# EAGLE board zx80 SD_12 (smd) build006.1 (STM32) (EAGLE 9.6.2), part 1 of 2
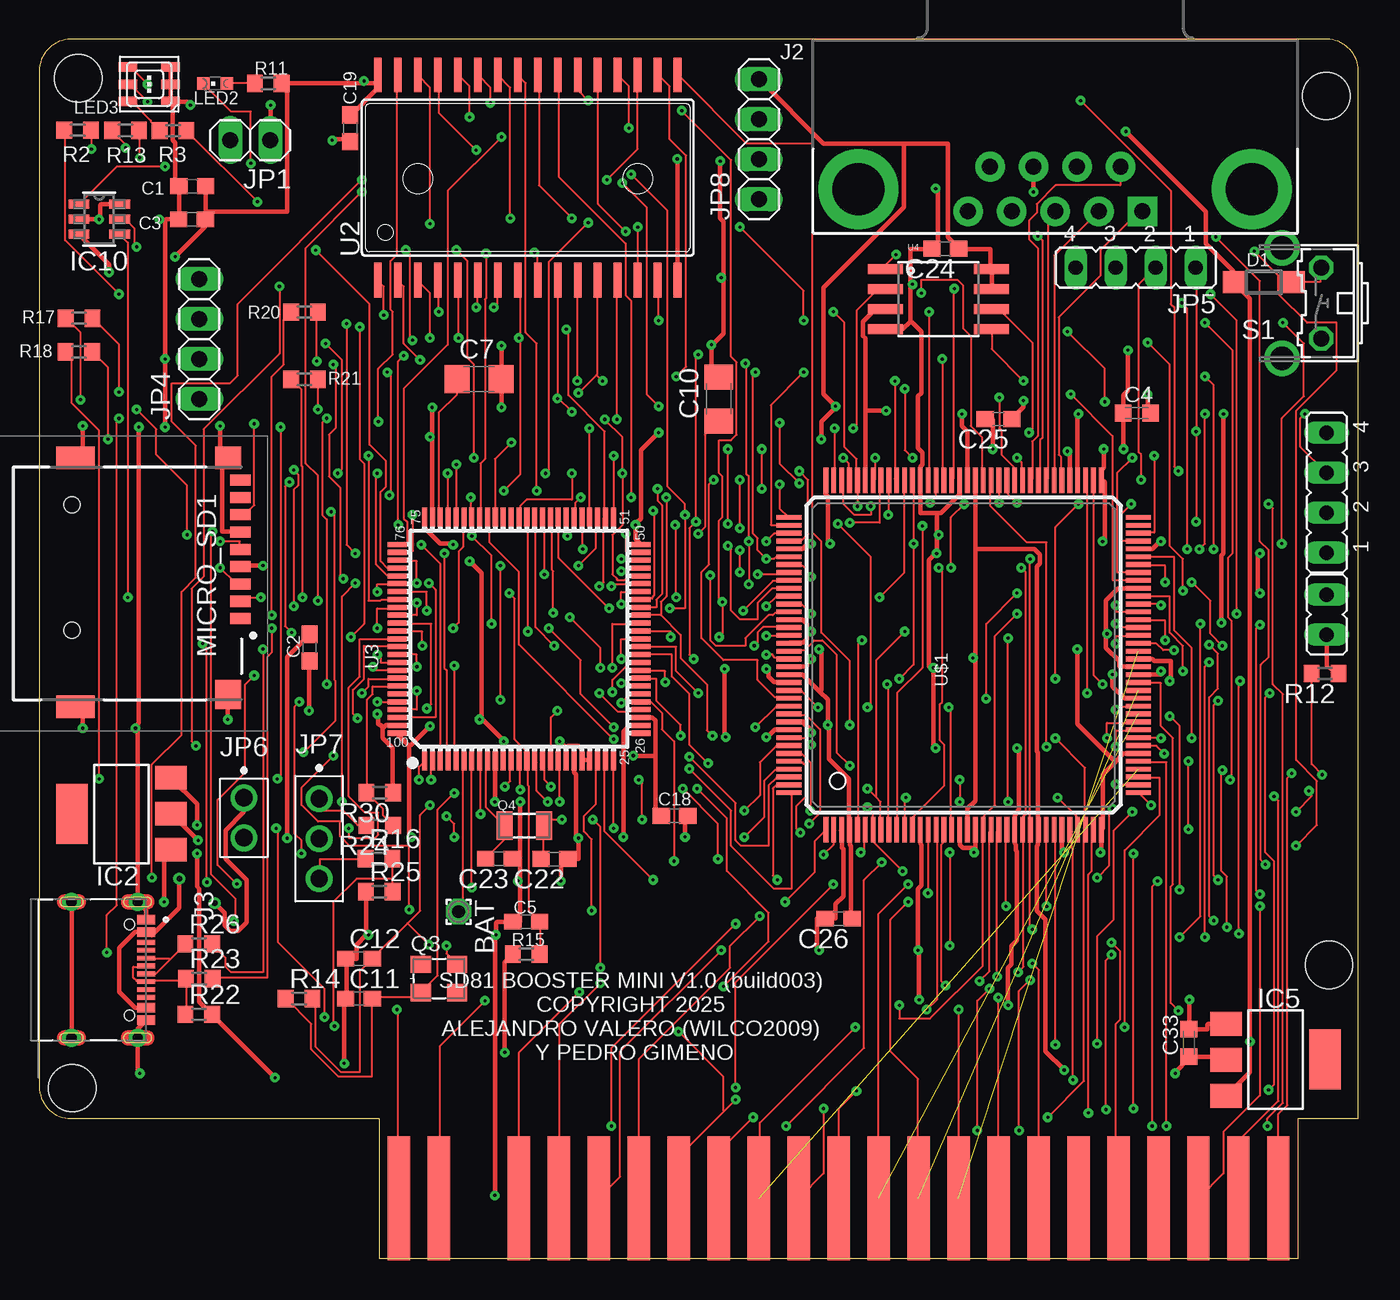
[diagram p3: board, top side]
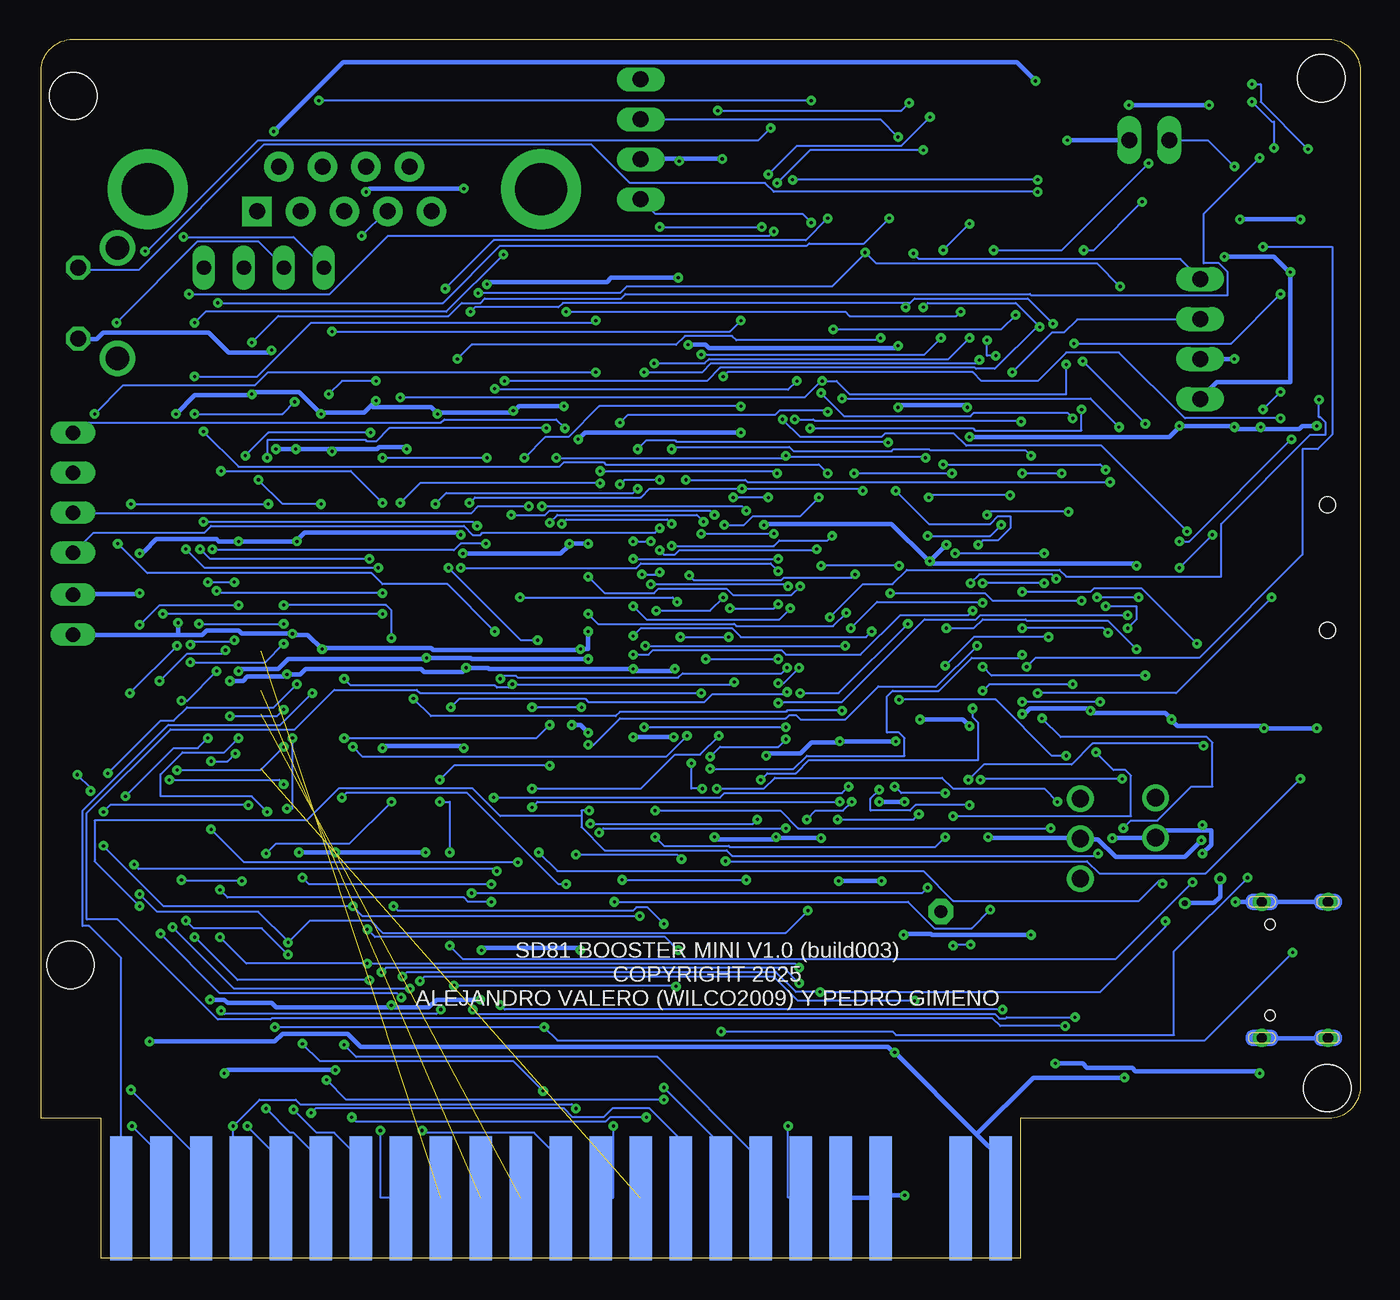
[diagram p4: board, bottom side, seen from below]

Size 83.82 x 77.47 mm. Coordinates in mm from the lower left corner, seen from the top.
Outline: 2,8.89 21.59,8.89 21.59,0 80.01,0 80.01,8.89 83.82,8.89 83.82,75.47 arc90 81.82,77.47 2,77.47 arc90 0,75.47 0,10.89 arc90 2,8.89
Copper layers (1*16): Top 0.035mm / dielectric 1.5mm / Bottom 0.035mm
Design rules "default *": minimum track width 5mil, minimum drill 0.2mm, track to track 6mil, track to pad 6mil, pad to pad 6mil, via to via 6mil, smd to smd 6mil, copper to edge 40mil, drill to drill 6mil, minimum pad ring 10mil, minimum via ring 8mil, stop-mask expansion 4mil, vias tented up to drill 999mil, thermal gap 10mil
Net classes: 1 VCC: width 0.3 mm; 2 3,3: width 0.3 mm
Holes 3 mm at 2.09,10.82 2.46,74.99 81.79,73.87 81.96,18.64

## Footprints (pad centres in the part's own frame; a part is rotated, then mirrored left to right if it is on the bottom)
EDGEPIN = smd 1.422 x 7.874: 1 0,0
1,6/0,8 = drill 0.813 pad 1.6 octagon: 1 0,0
C0603 = smd 1.1 x 1: 1 -0.85,0; 2 0.85,0
C0603K = smd 1.05 x 1.08: 1 -0.875,0; 2 0.875,0
C1206 = smd 1.6 x 1.8: 1 -1.4,0; 2 1.4,0
SOD123 = smd 1.4 x 1.4: A 1.9,0; C -1.9,0
SOT223 = smd 1.499 x 2.007: 1 -2.261,-3.15; 2 0.025,-3.15; 3 2.311,-3.15 | smd 3.81 x 2.007: 4 0,3.15
SOT-23-6_MC = smd 1.321 x 0.559: 1 -1.295,0.95; 2 -1.295,0; 3 -1.295,-0.95; 4 1.295,-0.95; 5 1.295,0; 6 1.295,0.95
DB9_MALE = drill 1.016 pad 1.88 square: 1 5.54,-1.42 | drill 1.016 pad 1.88: 2 2.77,-1.42; 3 0,-1.42; 4 -2.77,-1.42; 5 -5.54,-1.42; 6 4.15,1.42; 7 1.38,1.42; 8 -1.38,1.42; 9 -4.15,1.42 | drill 3.302 pad 5.08: G1 -12.5,0; G2 12.5,0
SHOUHAN_TYPE-C_16PIN_2MD__073_ = smd 0.6 x 1.14: A1_B12 -3.2,3.675; A4_B9 -2.4,3.675; B1_A12 3.2,3.675; B4_A9 2.4,3.675 | smd 0.3 x 1.14: A5 -1.25,3.675; A6 -0.25,3.675; A7 0.25,3.675; A8 1.25,3.675; B5 1.75,3.675; B6 0.75,3.675; B7 -0.75,3.675; B8 -1.75,3.675 | drill 0.65 pad 0.95: SH1 -4.325,3.125; SH2 4.325,3.125; SH3 -4.325,-1.075; SH4 4.325,-1.075 | hole 0.65: -2.89,2.605; 2.89,2.605
1X02 = drill 1.016 long: 1 -1.27,0; 2 1.27,0
JP1 = drill 0.914 long: 1 0,-1.27; 2 0,1.27
JP4 = drill 0.914 long: 1 -3.81,0; 2 -1.27,0; 3 1.27,0; 4 3.81,0
1X04 = drill 1.016 long: 1 -3.81,0; 2 -1.27,0; 3 1.27,0; 4 3.81,0
HDRV2W64P254_2X1_300X350X838B = drill 1.105 pad 1.705: 1 0,0; 2 0,-2.54
HDRV3W64P254_3X1_300X654X838B = drill 1.105 pad 1.705: 1 0,0; 2 0,-2.54; 3 0,-5.08
CHIPLED_0603 = smd 0.8 x 0.8: A 0,-0.75; C 0,0.75
3535-PLCC6 = smd 1.2 x 0.6: P1 1.35,-1.1; P2 1.35,0; P3 1.35,1.1; P4 -1.35,1.1; P5 -1.35,0; P6 -1.35,-1.1
TF-01A = smd 0.7 x 1.3: 1 2.23,7.174; 2 1.13,7.174; 3 0.03,7.174; 4 -1.07,7.174; 5 -2.17,7.174; 6 -3.27,7.174; 7 -4.37,7.174; 8 -5.47,7.174; CD1 -6.57,7.174 | smd 1.448 x 1.651: MP1 -7.989,6.4 | smd 1.448 x 2.438: MP2 -7.989,-3.3; MP3 7.836,-3.3 | smd 1.854 x 1.651: MP4 7.061,6.4 | hole 1: -5.004,-3.531; 2.972,-3.531
3.2X2.5_KX-7 = smd 1.3 x 1.1: 1 -1.15,-0.9; 2 1.15,-0.9; 3 1.15,0.9; 4 -1.15,0.9
3.2X1.5 = smd 1 x 1.8: 1 -1.25,0; 2 1.25,0
R0603 = smd 1 x 1.1: 1 -0.85,0; 2 0.85,0
B3F-31XX = drill 1.016 octagon: 1 -2.261,-1.245; 2 2.261,-1.245 | drill 1.499 pad 2.159: 3 -3.505,1.245; 4 3.505,1.245
SOP32-5 = smd 2.2 x 0.5: 1 -6.516,9.525; 2 -6.516,8.255; 3 -6.516,6.985; 4 -6.516,5.715; 5 -6.516,4.445; 6 -6.516,3.175; 7 -6.516,1.905; 8 -6.516,0.635; 9 -6.516,-0.635; 10 -6.516,-1.905; 11 -6.516,-3.175; 12 -6.516,-4.445; 13 -6.516,-5.715; 14 -6.516,-6.985; 15 -6.516,-8.255; 16 -6.516,-9.525; 17 6.516,-9.525; 18 6.516,-8.255; 19 6.516,-6.985; 20 6.516,-5.715; 21 6.516,-4.445; 22 6.516,-3.175; 23 6.516,-1.905; 24 6.516,-0.635; 25 6.516,0.635; 26 6.516,1.905; 27 6.516,3.175; 28 6.516,4.445; 29 6.516,5.715; 30 6.516,6.985; 31 6.516,8.255; 32 6.516,9.525
LQFP100-0.5-13.8X13.8MM = smd 1.2 x 0.32: 1 -7.75,6; 2 -7.75,5.5; 3 -7.75,5; 4 -7.75,4.5; 5 -7.75,4; 6 -7.75,3.5; 7 -7.75,3; 8 -7.75,2.5; 9 -7.75,2; 10 -7.75,1.5; 11 -7.75,1; 12 -7.75,0.5; 13 -7.75,0; 14 -7.75,-0.5; 15 -7.75,-1; 16 -7.75,-1.5; 17 -7.75,-2; 18 -7.75,-2.5; 19 -7.75,-3; 20 -7.75,-3.5; 21 -7.75,-4; 22 -7.75,-4.5; 23 -7.75,-5; 24 -7.75,-5.5; 25 -7.75,-6; 51 7.75,-6; 52 7.75,-5.5; 53 7.75,-5; 54 7.75,-4.5; 55 7.75,-4; 56 7.75,-3.5; 57 7.75,-3; 58 7.75,-2.5; 59 7.75,-2; 60 7.75,-1.5; 61 7.75,-1; 62 7.75,-0.5; 63 7.75,0; 64 7.75,0.5; 65 7.75,1; 66 7.75,1.5; 67 7.75,2; 68 7.75,2.5; 69 7.75,3; 70 7.75,3.5; 71 7.75,4; 72 7.75,4.5; 73 7.75,5; 74 7.75,5.5; 75 7.75,6 | smd 0.32 x 1.2: 26 -6,-7.75; 27 -5.5,-7.75; 28 -5,-7.75; 29 -4.5,-7.75; 30 -4,-7.75; 31 -3.5,-7.75; 32 -3,-7.75; 33 -2.5,-7.75; 34 -2,-7.75; 35 -1.5,-7.75; 36 -1,-7.75; 37 -0.5,-7.75; 38 0,-7.75; 39 0.5,-7.75; 40 1,-7.75; 41 1.5,-7.75; 42 2,-7.75; 43 2.5,-7.75; 44 3,-7.75; 45 3.5,-7.75; 46 4,-7.75; 47 4.5,-7.75; 48 5,-7.75; 49 5.5,-7.75; 50 6,-7.75; 76 6,7.75; 77 5.5,7.75; 78 5,7.75; 79 4.5,7.75; 80 4,7.75; 81 3.5,7.75; 82 3,7.75; 83 2.5,7.75; 84 2,7.75; 85 1.5,7.75; 86 1,7.75; 87 0.5,7.75; 88 0,7.75; 89 -0.5,7.75; 90 -1,7.75; 91 -1.5,7.75; 92 -2,7.75; 93 -2.5,7.75; 94 -3,7.75; 95 -3.5,7.75; 96 -4,7.75; 97 -4.5,7.75; 98 -5,7.75; 99 -5.5,7.75; 100 -6,7.75
SO08-EIAJ = smd 0.61 x 2.21: 1 -1.905,-3.378; 2 -0.635,-3.378; 3 0.635,-3.378; 4 1.905,-3.378; 5 1.905,3.353; 6 0.635,3.353; 7 -0.635,3.353; 8 -1.905,3.353
TQ144 = smd 1.6 x 0.3: P1 -11.1,8.75; P2 -11.1,8.25; P3 -11.1,7.75; P4 -11.1,7.25; P5 -11.1,6.75; P6 -11.1,6.25; P7 -11.1,5.75; P8 -11.1,5.25; P9 -11.1,4.75; P10 -11.1,4.25; P11 -11.1,3.75; P12 -11.1,3.25; P13 -11.1,2.75; P14 -11.1,2.25; P15 -11.1,1.75; P16 -11.1,1.25; P17 -11.1,0.75; P18 -11.1,0.25; P19 -11.1,-0.25; P20 -11.1,-0.75; P21 -11.1,-1.25; P22 -11.1,-1.75; P23 -11.1,-2.25; P24 -11.1,-2.75; P25 -11.1,-3.25; P26 -11.1,-3.75; P27 -11.1,-4.25; P28 -11.1,-4.75; P29 -11.1,-5.25; P30 -11.1,-5.75; P31 -11.1,-6.25; P32 -11.1,-6.75; P33 -11.1,-7.25; P34 -11.1,-7.75; P35 -11.1,-8.25; P36 -11.1,-8.75; P73 11.1,-8.75; P74 11.1,-8.25; P75 11.1,-7.75; P76 11.1,-7.25; P77 11.1,-6.75; P78 11.1,-6.25; P79 11.1,-5.75; P80 11.1,-5.25; P81 11.1,-4.75; P82 11.1,-4.25; P83 11.1,-3.75; P84 11.1,-3.25; P85 11.1,-2.75; P86 11.1,-2.25; P87 11.1,-1.75; P88 11.1,-1.25; P89 11.1,-0.75; P90 11.1,-0.25; P91 11.1,0.25; P92 11.1,0.75; P93 11.1,1.25; P94 11.1,1.75; P95 11.1,2.25; P96 11.1,2.75; P97 11.1,3.25; P98 11.1,3.75; P99 11.1,4.25; P100 11.1,4.75; P101 11.1,5.25; P102 11.1,5.75; P103 11.1,6.25; P104 11.1,6.75; P105 11.1,7.25; P106 11.1,7.75; P107 11.1,8.25; P108 11.1,8.75 | smd 0.3 x 1.6: P37 -8.75,-11.1; P38 -8.25,-11.1; P39 -7.75,-11.1; P40 -7.25,-11.1; P41 -6.75,-11.1; P42 -6.25,-11.1; P43 -5.75,-11.1; P44 -5.25,-11.1; P45 -4.75,-11.1; P46 -4.25,-11.1; P47 -3.75,-11.1; P48 -3.25,-11.1; P49 -2.75,-11.1; P50 -2.25,-11.1; P51 -1.75,-11.1; P52 -1.25,-11.1; P53 -0.75,-11.1; P54 -0.25,-11.1; P55 0.25,-11.1; P56 0.75,-11.1; P57 1.25,-11.1; P58 1.75,-11.1; P59 2.25,-11.1; P60 2.75,-11.1; P61 3.25,-11.1; P62 3.75,-11.1; P63 4.25,-11.1; P64 4.75,-11.1; P65 5.25,-11.1; P66 5.75,-11.1; P67 6.25,-11.1; P68 6.75,-11.1; P69 7.25,-11.1; P70 7.75,-11.1; P71 8.25,-11.1; P72 8.75,-11.1; P109 8.75,11.1; P110 8.25,11.1; P111 7.75,11.1; P112 7.25,11.1; P113 6.75,11.1; P114 6.25,11.1; P115 5.75,11.1; P116 5.25,11.1; P117 4.75,11.1; P118 4.25,11.1; P119 3.75,11.1; P120 3.25,11.1; P121 2.75,11.1; P122 2.25,11.1; P123 1.75,11.1; P124 1.25,11.1; P125 0.75,11.1; P126 0.25,11.1; P127 -0.25,11.1; P128 -0.75,11.1; P129 -1.25,11.1; P130 -1.75,11.1; P131 -2.25,11.1; P132 -2.75,11.1; P133 -3.25,11.1; P134 -3.75,11.1; P135 -4.25,11.1; P136 -4.75,11.1; P137 -5.25,11.1; P138 -5.75,11.1; P139 -6.25,11.1; P140 -6.75,11.1; P141 -7.25,11.1; P142 -7.75,11.1; P143 -8.25,11.1; P144 -8.75,11.1

## Placement (x,y rotation side)
1A  D7  [EDGEPIN]  22.86,3.81 0 top
1B  VCC  [EDGEPIN]  22.86,3.81 180 bottom
2A  /RAMCS  [EDGEPIN]  25.4,3.81 0 top
2B  9V  [EDGEPIN]  25.4,3.81 180 bottom
4A  D0  [EDGEPIN]  30.48,3.81 0 top
4B  GND  [EDGEPIN]  30.48,3.81 180 bottom
5A  D1  [EDGEPIN]  33.02,3.81 0 top
5B  GND  [EDGEPIN]  33.02,3.81 180 bottom
6A  D2  [EDGEPIN]  35.56,3.81 0 top
6B  /CLOCK  [EDGEPIN]  35.56,3.81 180 bottom
7A  D6  [EDGEPIN]  38.1,3.81 0 top
7B  A0  [EDGEPIN]  38.1,3.81 180 bottom
8A  D5  [EDGEPIN]  40.64,3.81 0 top
8B  A1  [EDGEPIN]  40.64,3.81 180 bottom
9A  D3  [EDGEPIN]  43.18,3.81 0 top
9B  A2  [EDGEPIN]  43.18,3.81 180 bottom
10A  D4  [EDGEPIN]  45.72,3.81 0 top
10B  A3  [EDGEPIN]  45.72,3.81 180 bottom
11A  A6  [EDGEPIN]  48.26,3.81 0 top
11B  A15  [EDGEPIN]  48.26,3.81 180 bottom
12A  /NMI  [EDGEPIN]  50.8,3.81 0 top
12B  A14  [EDGEPIN]  50.8,3.81 180 bottom
13A  /HALT  [EDGEPIN]  53.34,3.81 0 top
13B  A13  [EDGEPIN]  53.34,3.81 180 bottom
14A  /MREQ  [EDGEPIN]  55.88,3.81 0 top
14B  A12  [EDGEPIN]  55.88,3.81 180 bottom
15A  /IORQ  [EDGEPIN]  58.42,3.81 0 top
15B  A11  [EDGEPIN]  58.42,3.81 180 bottom
16A  /RD  [EDGEPIN]  60.96,3.81 0 top
16B  A10  [EDGEPIN]  60.96,3.81 180 bottom
17A  /WR  [EDGEPIN]  63.5,3.81 0 top
17B  A9  [EDGEPIN]  63.5,3.81 180 bottom
18A  /BUSAK  [EDGEPIN]  66.04,3.81 0 top
18B  A8  [EDGEPIN]  66.04,3.81 180 bottom
19A  /WAIT  [EDGEPIN]  68.58,3.81 0 top
19B  A7  [EDGEPIN]  68.58,3.81 180 bottom
20A  /BUSRQ  [EDGEPIN]  71.12,3.81 0 top
20B  A6  [EDGEPIN]  71.12,3.81 180 bottom
21A  /RESET  [EDGEPIN]  73.66,3.81 0 top
21B  A5  [EDGEPIN]  73.66,3.81 180 bottom
22A  /M1  [EDGEPIN]  76.2,3.81 0 top
22B  A4  [EDGEPIN]  76.2,3.81 180 bottom
23A  /RFSH  [EDGEPIN]  78.74,3.81 0 top
23B  /ROMCS  [EDGEPIN]  78.74,3.81 180 bottom
BAT  [1,6/0,8]  26.64,22.03 270 top
C1  100nF  [C0603]  9.72,68.13 180 top
C2  100nF  [C0603]  17.17,38.81 270 top
C3  100nF  [C0603]  9.71,66.02 180 top
C4  100nF  [C0603K]  69.75,53.73 0 top
C5  22pF  [C0603]  30.94,21.39 0 top
C7  10uF  [C1206]  27.94,55.88 0 top
C10  10uF  [C1206]  43.18,54.61 90 top
C11  22pF  [C0603]  20.32,16.51 0 top
C12  22pF  [C0603]  20.32,19.05 0 top
C18  100nF  [C0603]  40.37,28.11 0 top
C19  100nF  [C0603]  19.75,71.81 270 top
C22  22pF  [C0603]  32.73,25.38 180 top
C23  22pF  [C0603]  29.21,25.4 180 top
C24  0.1uF  [C0603]  57.58,64.17 180 top
C25  0.1uF  [C0603]  60.96,53.34 180 top
C26  100nF  [C0603]  50.8,21.59 180 top
C33  10uF  [C0603K]  73.05,13.7 90 top
D1  [SOD123]  77.81,62.03 0 top
IC2  REG1117  [SOT223]  5.23,28.23 90 top
IC5  1.2V  [SOT223]  78.57,12.64 270 top
IC10  MCP4725  [SOT-23-6_MC]  3.81,66.04 0 top
J2  JOYSTICK  [DB9_MALE]  64.57,67.96 0 top
J3  TYPE-C_16PIN_2MD__073_  [SHOUHAN_TYPE-C_16PIN_2MD__073_]  3.12,18.33 270 top
JP1  SOUND  [1X02]  13.41,71.06 180 top
JP2  [JP1]  81.81,40.91 0 top
JP3  JTAG  [JP4]  81.81,48.65 90 top
JP4  SERIAL  [1X04]  10.16,58.42 90 top
JP5  RGB  [JP4]  69.68,62.96 180 top
JP6  PWR_SRC  [HDRV2W64P254_2X1_300X350X838B]  13,29.26 0 top
JP7  BOOT  [HDRV3W64P254_3X1_300X654X838B]  17.78,29.21 0 top
JP8  ST-LINK-V2  [1X04]  45.72,71.12 90 top
LED2  SD  [CHIPLED_0603]  11.18,74.66 90 top
LED3  STATUS  [3535-PLCC6]  6.98,74.62 0 top
MICRO_SD1  TF-01A  [TF-01A]  5.6,42.89 270 top
Q3  8MHz  [3.2X2.5_KX-7]  25.4,17.78 0 top
Q4  32767Hz  [3.2X1.5]  30.82,27.49 0 top
R2  150  [R0603]  2.44,71.69 0 top
R3  68  [R0603]  8.51,71.67 180 top
R11  680  [R0603]  14.56,74.66 180 top
R12  2K  [R0603]  81.71,37.16 180 top
R13  150  [R0603]  5.48,71.67 180 top
R14  1M  [R0603]  16.51,16.51 0 top
R15  [R0603]  30.94,19.34 180 top
R16  510  [R0603]  21.59,25.4 0 top
R17  3k3  [R0603]  2.52,59.75 0 top
R18  3k3  [R0603]  2.52,57.61 0 top
R20  3k3  [R0603]  16.85,60.14 0 top
R21  3k3  [R0603]  16.85,55.86 180 top
R22  1K5  [R0603]  10.14,15.5 0 top
R23  22R  [R0603]  10.16,17.78 0 top
R24  510  [R0603]  21.63,27.51 180 top
R25  10K  [R0603]  21.6,23.3 0 top
R26  22R  [R0603]  10.13,19.98 0 top
R30  10K  [R0603]  21.63,29.59 180 top
S1  RESET  [B3F-31XX]  80.22,60.71 90 top
U2  AS6C4008  [SOP32-5]  31.04,68.68 90 top
U3  MCU-STM32F407VET6(LQFP100)  [LQFP100-0.5-13.8X13.8MM]  30.48,39.37 90 top
U4  FLASH-SPI-25XX  [SO08-EIAJ]  57.15,60.96 270 top
U$1  XC6SLX9-2TQG144C  [TQ144]  58.74,38.34 90 top

## Tracks (layer width: path | path; a pad name or v marks a point on that pad's centre or on a via)
1V2  (via drill 0.2)
  Top 0.3: IC5.2 75.4,12.66 75.4,12.8 73.09,12.8 C33.1 73.03,12.66 72.19,11.82 v72.19,11.75 | 59.47,45.07 59.47,49.4 U$1.P89 | 59.47,45.07 59.47,38.16 | 59.47,38.16 59.47,29.08 58.98,28.59 58.98,27.26 U$1.P19 | 59.47,45.07 63.25,45.07 63.59,44.72 63.59,44.16 63.39,43.95 63.39,32.22 63.46,32.15 63.46,27.26 U$1.P28 63.46,27.12 63.46,26.28 63.39,26.21 63.39,22.09 63.94,21.53 63.94,13.15 v65.13,11.96 | v49.07,38.09 48.79,37.81 48.79,37.6 47.67,37.6 U$1.P128 | v59.33,38.16 59.47,38.16 | v71.28,37.32 71.28,37.11 69.88,37.11 U$1.P52
  Bottom 0.3: v49.07,38.09 56.47,38.09 56.54,38.16 v59.33,38.16 59.47,38.09 68.14,38.09 68.76,37.46 71.14,37.46 v71.28,37.32 | v72.19,11.75 71.98,11.96 v65.13,11.96
3V3  (via drill 0.2)
  Top 0.3: C26.1 51.58,21.6 51.58,26.21 51.51,26.28 51.51,27.19 U$1.P4 51.51,27.33 51.44,27.4 51.44,30.47 50.18,31.73 50.18,33.76 v50.11,33.9 50.11,35.5 49.59,36.03 | 48.79,39.83 48.79,40.32 48.51,40.6 47.67,40.6 U$1.P122 | 48.79,39.83 48.79,39.34 48.58,39.14 47.67,39.14 U$1.P125 | v49.07,33.41 49.07,33.55 48.58,34.04 48.58,34.11 47.67,34.11 U$1.P135 | 49.59,36.03 48.51,37.11 47.67,37.11 U$1.P129 | v49.56,38.72 49.69,38.58 49.69,36.13 49.59,36.03 | v49.07,39.83 48.79,39.83 | 59.4,26.07 59.47,26.07 59.47,27.19 U$1.P20 | 59.4,26.07 58.71,26.07 58.5,26.28 58.5,27.19 U$1.P18 | v65.13,25.79 64.99,25.93 64.99,27.19 U$1.P31 | v67.44,25.79 67.51,25.86 67.51,27.19 U$1.P36 67.58,27.33 67.58,30.75 68.38,31.56 | 68.38,31.56 68.9,32.08 69.81,32.08 U$1.P42 | v59.4,25.79 59.4,26.07 | 67.79,39.69 67.79,41.79 68.56,42.56 69.81,42.56 U$1.P63 | 67.79,39.69 67.79,38.79 68.62,37.95 68.62,37.6 69.81,37.6 U$1.P53 | R12.1 81.83,37.62 81.83,39.62 JP2.1 | v67.86,39.69 67.79,39.69 | 68.38,31.56 65.97,33.97 v65.97,38.72 | 52.49,53.87 52.49,58.48 52.35,58.62 52.35,59.53 53.12,60.3 53.75,60.3 U4.3 | 52.49,53.87 52.49,49.47 U$1.P103 | v70.44,54.92 70.44,53.87 70.58,53.73 C4.2 | v66.04,53.66 65.97,53.59 65.97,49.47 U$1.P76 | v62.55,54.5 62.55,54.08 61.85,53.38 C25.1 | v58.64,53.66 58.64,52.9 58.98,52.55 58.98,49.47 U$1.P90 | v53.82,53.87 52.49,53.87 | U4.7 60.52,61.63 60.52,62.74 U4.8 60.45,62.88 60.45,64.14 58.5,64.14 C24.1 58.36,64.28 57.73,64.91 57.73,70.85 54.93,70.85 | 54.93,70.85 49.83,70.85 45.78,74.9 JP8.4 | 54.93,70.85 54.93,66.8 49.83,61.7 49.83,54.92 v50.6,54.15 50.53,54.01 49.69,53.17 v49.69,52.06
  Top 0.3: 23.5,32.57 22.73,33.34 U3.100 | 23.5,32.57 23.5,26.91 v23.64,26.77 | v10.09,26.56 8.41,28.24 IC2.2 | 39.15,31.94 39.15,34.18 38.94,34.39 38.24,34.39 U3.28 | 39.15,31.94 39.15,28.52 39.5,28.17 C18.1 | U3.22 34.96,31.66 34.54,31.66 U3.21 34.47,31.8 34.47,32.36 34.26,32.57 33.56,32.57 33.45,32.46 | 33.45,32.46 33.49,32.43 33.49,31.66 U3.19 | 33.45,32.46 v33.07,32.85 | U3.11 29.51,31.66 v29.51,32.85 29.44,32.99 28.11,34.31 | v26.3,45.35 26.3,45.42 25.46,45.42 24.48,46.4 24.48,47.1 U3.75 | v27.34,44.3 28.11,43.54 28.11,34.31 | U3.50 38.17,45.42 37.89,45.7 v37.89,46.61 37.96,46.75 38.24,47.03 38.24,51.36 v39.36,52.48 | v14.21,44.02 12.81,44.02 MICRO_SD1.4 | v37.75,31.94 39.15,31.94 | v24.83,33.83 23.64,32.64 23.5,32.57 | v27.97,34.25 28.11,34.31 | v75.12,40.39 75.12,44.65 75.26,44.79 v75.26,53.66
  Bottom 0.3: v49.07,33.41 49.56,33.9 v50.11,33.9 | v49.07,39.83 49.07,38.72 v49.56,38.72 49.69,38.65 58.92,38.65 59.06,38.79 65.83,38.79 v65.97,38.72 66.88,39.62 67.72,39.62 v67.86,39.69 71.07,39.69 71.28,39.9 73.3,39.9 73.58,39.62 75.12,39.62 | v67.44,25.79 v65.13,25.79 v59.4,25.79 | 75.12,39.62 81.76,39.62 JP2.1 | 62.86,54.19 63.32,53.73 65.9,53.73 v66.04,53.66 67.44,55.06 70.3,55.06 v70.44,54.92 70.58,54.85 74.07,54.85 v75.26,53.66 | 62.86,54.19 v62.55,54.5 | 62.86,54.19 62.76,54.08 59.06,54.08 v58.64,53.66 58.5,53.73 53.96,53.73 v53.82,53.87 53.68,53.94 53.47,54.15 v50.6,54.15 | v23.64,26.77 23.57,26.7 17.84,26.7 JP7.2 17.63,26.63 16.66,26.63 15.54,25.51 11.14,25.51 v10.09,26.56 | v29.51,32.85 v33.07,32.85 33.21,32.78 34.89,32.78 35.58,32.08 37.61,32.08 v37.75,31.94 | v27.34,44.3 v26.3,45.35 | v37.89,46.61 37.82,46.68 29.79,46.68 27.48,44.37 v27.34,44.3 | v14.21,44.02 14.35,44.16 27.27,44.16 v27.34,44.3 | v24.83,33.83 25.25,34.25 v27.97,34.25 | v49.69,52.06 49.28,52.48 v39.36,52.48 | v75.12,40.39 75.12,39.62
/CLOCK  (via drill 0.2)
  Top 0.127: v61.43,22.37 61.43,27.19 U$1.P24 | v44.25,21.25 36.35,13.36 v36.35,8.4
  Bottom 0.127: v61.43,22.37 61.15,22.09 46.2,22.09 45.99,22.3 45.3,22.3 v44.25,21.25 | v36.35,8.4 36.35,3.86 35.58,3.86 6B.1
/HALT  (via drill 0.2)
  Top 0.127: 53.33,3.86 13A.1 53.34,21.9 v55.21,23.77 | v67.86,33.06 67.86,34.04 69.81,34.04 U$1.P46 | v68.2,28.59 68,28.38 68,24.96 v67.23,24.19
  Bottom 0.127: v67.86,33.06 67.86,28.59 v68.2,28.59 | v67.23,24.19 66.81,23.77 v55.21,23.77
/IORQ  (via drill 0.2)
  Top 0.127: v72.4,15.73 71.91,16.22 71.91,23.63 72.05,23.77 72.05,33.06 71.28,33.83 71.28,36.55 69.88,36.55 U$1.P51 | v58.43,15.8 58.43,3.86 15A.1
  Bottom 0.127: v72.4,15.73 72.19,15.53 58.71,15.53 v58.43,15.8
/M1  (via drill 0.2)
  Top 0.127: v73.23,33.06 73.23,38.79 72.12,39.9 72.12,44.58 69.88,44.58 U$1.P67 | v78.47,29.36 78.75,29.08 78.75,10.01 76.24,7.49 76.24,3.86 22A.1
  Bottom 0.127: v73.23,33.06 73.86,32.43 75.4,32.43 v78.47,29.36
/MEM_CE  (via drill 0.2)
  Top 0.127: v62.13,48.01 61.57,48.56 61.57,49.33 61.5,49.4 U$1.P85 | v72.4,50.03 72.12,50.31 72.12,60.44 71.91,60.65 71.91,67.84 v66.18,73.57 | v34.89,73.57 34.26,74.2 34.26,75.18 U2.22
  Bottom 0.127: v62.13,48.01 64.15,50.03 v72.4,50.03 | v34.89,73.57 v66.18,73.57
/MEM_OE  (via drill 0.2)
  Top 0.127: v58.15,61.63 58.08,61.56 58.08,49.54 58.01,49.47 U$1.P92 | v33.84,66.1 31.74,68.19 31.74,75.18 U2.24
  Bottom 0.127: v58.15,61.63 55.07,64.7 35.24,64.7 v33.84,66.1
/MREQ  (via drill 0.2)
  Top 0.127: v68.42,34.87 68.42,35.08 69.81,35.08 U$1.P48 | v71.84,34.45 72.47,33.83 v72.47,23.42 | v55.21,22.65 54.1,21.53 54.1,13.15 55.84,11.41 55.84,3.86 14A.1
  Bottom 0.127: v68.42,34.87 68.83,34.45 v71.84,34.45 | v72.47,23.42 71.98,22.93 56.96,22.93 56.68,22.65 v55.21,22.65
/NMI  (via drill 0.2)
  Top 0.127: v71.28,33.06 69.88,33.06 U$1.P44 | v69.46,28.38 68.28,27.19 68.28,21.53 67.23,20.48 v67.23,13.64 | v51.93,10.64 50.81,9.52 50.81,3.86 12A.1
  Bottom 0.127: v71.28,33.06 72.19,32.15 74.84,32.15 76.24,30.75 76.24,29.36 70.44,29.36 v69.46,28.38 | v67.23,13.64 66.11,12.52 53.82,12.52 v51.93,10.64
/OE_OL  (via drill 0.2)
  Top 0.127: v36.98,43.67 36.98,43.81 38.17,43.81 U3.47 | v57.17,43.88 57.38,43.67 57.38,35.36 57.24,35.22 57.24,32.92 57.52,32.64 57.52,30.05 55.49,28.03 55.49,27.26 U$1.P12
  Bottom 0.127: v36.98,43.67 37.47,44.16 45.71,44.16 45.99,43.88 v57.17,43.88
/RAMCS  (via drill 0.2)
  Top 0.127: v59.75,17.62 60.38,18.25 60.38,27.12 60.45,27.19 U$1.P22 | v28.32,16.36 25.46,13.5 25.46,3.86 2A.1
  Bottom 0.127: v59.75,17.62 59.47,17.9 37.26,17.9 35.72,16.36 v28.32,16.36
/RD  (via drill 0.2)
  Top 0.127: v72.12,38.65 71.42,38.65 71,39.06 69.88,39.06 U$1.P56 | v76.31,36.69 76.24,36.62 v76.24,20.62 | v60.94,16.57 60.94,3.86 16A.1
  Bottom 0.127: v72.12,38.65 72.33,38.44 74.56,38.44 v76.31,36.69 | v76.24,20.62 72.47,16.85 61.22,16.85 v60.94,16.57
/RESET  (via drill 0.2)
  Top 0.127: v21.48,35.36 22.66,35.36 U3.96 | v16.52,35.36 16.24,35.08 16.24,26.98 16.66,26.56 v16.66,25.72 | v49,28.45 49,31.52 48.44,32.08 47.67,32.08 U$1.P139 | v77.56,22.37 77.56,10.36 75.26,8.05 75.26,5.4 73.72,3.86 21A.1
  Bottom 0.127: v16.52,35.36 v21.48,35.36 | v16.66,25.72 16.8,25.58 39.92,25.58 40.27,25.93 48.02,25.93 49.49,27.4 49.49,28.1 | 49.49,28.1 49.49,28.45 v49,28.45 | v77.56,22.37 80.43,25.23 80.43,27.82 66.95,27.82 64.92,29.84 56.4,29.84 54.65,28.1 49.49,28.1
/RFSH  (via drill 0.2)
  Top 0.127: v67.58,36.48 67.02,37.04 67.02,49.4 U$1.P74 | v79.59,30.82 79.31,30.54 79.31,9.73 78.75,9.17 78.75,3.86 23A.1
  Bottom 0.127: v67.58,36.48 69.04,35.01 74.56,35.01 75.4,34.18 76.24,34.18 v79.59,30.82
/ROMCS  (via drill 0.2)
  Top 0.127: v66.6,35.92 66.6,49.33 66.53,49.4 U$1.P75
  Bottom 0.127: v66.6,35.92 68.62,33.9 75.75,33.9 81.2,28.45 81.2,21.11 80.78,21.11 78.75,19.09 78.75,3.86 23B.1
/WAIT  (via drill 0.2)
  Top 0.127: v35.1,22.09 35.1,26.63 34.61,27.12 34.61,28.1 35.38,28.87 35.38,31.52 35.45,31.59 U3.23 | v68.14,20.07 68.69,19.51 68.69,15.18 68.42,14.9 68.42,4 68.56,3.86 19A.1 | v71.28,41.51 71.28,41.58 69.88,41.58 U$1.P61 | v77.56,40.25 77.36,40.04 77.36,23.35 v77.56,23.14
  Bottom 0.127: v35.1,22.09 36.49,20.7 62.13,20.7 62.9,21.46 66.74,21.46 v68.14,20.07 68.14,20.14 70.02,22.02 76.45,22.02 v77.56,23.14 | v71.28,41.51 76.31,41.51 v77.56,40.25
/WR  (via drill 0.2)
  Top 0.127: v32.3,29.01 31.6,29.71 31.6,31.52 31.53,31.59 U3.15 | v35.17,27.89 35.66,27.4 v35.66,18.46 | v63.11,18.74 63.53,18.32 63.53,3.86 17A.1 | v68.42,40.32 68.42,40.11 69.81,40.11 U$1.P58 | v73.79,40.32 73.79,21.74 v72.47,20.41
  Bottom 0.127: v32.3,29.01 32.86,28.45 34.61,28.45 v35.17,27.89 | v35.66,18.46 35.94,18.74 v63.11,18.74 70.79,18.74 v72.47,20.41 | v73.79,40.32 v68.42,40.32
/WR'  (via drill 0.2)
  Top 0.127: v53.12,50.87 53.12,49.54 53.05,49.47 U$1.P102 | v39.36,54.15 38.59,54.92 38.59,66.8 v37.05,68.33 | v27.76,70.43 25.39,72.8 25.39,75.18 U2.29
  Bottom 0.127: v53.12,50.87 51.79,52.2 50.32,52.2 48.37,54.15 v39.36,54.15 | v37.05,68.33 34.96,70.43 v27.76,70.43
A0  (via drill 0.2)
  Top 0.127: v64.57,13.57 64.57,27.12 64.5,27.19 U$1.P30
  Bottom 0.127: v64.57,13.57 63.81,12.8 44.67,12.8 38.1,6.24 7B.1
A0'  (via drill 0.2)
  Top 0.127: v23.99,36.06 23.99,34.87 U3.97 | v18.26,36.48 18.26,46.96 17.98,47.24 17.98,53.11 v18.26,53.38 | 35.41,56.14 35.45,56.18 35.45,62.12 U2.12 | 35.41,56.14 v34.26,54.99 | v62.13,50.87 62.41,50.59 62.41,49.54 62.48,49.47 U$1.P83 | v55.49,50.87 55,51.36 v55,55.27 | 35.41,56.14 v35.8,55.76
  Bottom 0.127: v23.99,36.06 23.57,36.48 v18.26,36.48 | v18.26,53.38 18.61,53.73 24.55,53.73 24.76,53.52 32.79,53.52 v34.26,54.99 | v55.49,50.87 v62.13,50.87 | v55,55.27 54.93,55.2 36.35,55.2 v35.8,55.76
A1  (via drill 0.2)
  Top 0.127: v64.71,29.29 65.9,28.1 65.9,27.33 65.97,27.26 U$1.P33 | v50.46,23.77 44.25,17.55 v44.25,10.85
  Bottom 0.127: v64.71,29.29 64.43,29.57 56.75,29.57 50.95,23.77 v50.46,23.77 | v44.25,10.85 40.68,7.28 40.68,3.86 8B.1
A1'  (via drill 0.2)
  Top 0.127: v24.76,42.91 25.18,42.49 25.18,34.39 22.73,34.39 U3.98 | v19.31,43.19 19.1,43.4 19.1,48.98 18.4,49.68 18.4,52.34 18.82,52.76 18.82,56.67 v18.68,56.81 | v34.19,55.76 34.19,62.12 U2.11 | v61.01,54.71 61.01,52.76 61.15,52.62 61.15,51.08 61.92,50.31 61.92,49.47 U$1.P84
  Bottom 0.127: v24.76,42.91 24.2,43.47 19.59,43.47 v19.31,43.19 | v18.68,56.81 18.68,54.92 32.44,54.92 33.28,55.76 v34.19,55.76 34.26,55.76 35.31,54.71 v61.01,54.71
A2  (via drill 0.2)
  Top 0.127: v66.67,9.24 66.67,24.4 66.88,24.61 66.88,27.12 66.95,27.19 U$1.P35
  Bottom 0.127: v66.67,9.24 66.39,9.52 50.6,9.52 50.04,8.96 48.09,8.96 47.53,9.52 45.16,9.52 43.2,7.56 43.2,3.86 9B.1
A2'  (via drill 0.2)
  Top 0.127: v24.13,30.4 24.13,31.24 24.48,31.59 U3.1 | v15.12,30.47 15.33,30.68 v15.33,52.83 | 32.93,54.71 32.93,62.12 U2.10 | v61.01,48.01 61.01,49.4 U$1.P86 | v48.3,49.26 47.04,50.52 v47.04,53.11 | 32.93,54.71 v33.84,53.8 | 32.93,54.71 v32.93,54.64
  Bottom 0.127: v24.13,30.4 24.06,30.47 v15.12,30.47 | v15.33,52.83 17.15,54.64 v32.93,54.64 | v61.01,48.01 59.75,49.26 v48.3,49.26 | v47.04,53.11 46.55,53.59 37.19,53.59 36.91,53.87 33.91,53.87 v33.84,53.8
A3  (1 unrouted)
A3'  (via drill 0.2)
  Top 0.127: v24.9,30.4 24.9,31.52 24.97,31.59 U3.2 | v9.95,32.57 9.67,32.85 9.67,42.56 10.44,43.33 10.44,52.69 15.26,57.51 v15.26,61.77 | v31.46,63.93 31.67,63.72 31.67,62.19 U2.9 | v56.05,61.35 56.05,62.19 58.36,62.19 58.71,61.84 58.71,59.11 59.19,58.62 59.19,52.9 59.89,52.2 59.89,49.54 59.96,49.47 U$1.P88
  Bottom 0.127: v24.9,30.4 23.92,31.38 18.33,31.38 17.01,32.71 10.09,32.71 v9.95,32.57 | v15.26,61.77 16.73,63.23 30.77,63.23 v31.46,63.93 31.46,63.86 33.56,61.77 46.62,61.77 47.04,61.35 v56.05,61.35
A4  (via drill 0.2)
  Top 0.127: v69.39,47.94 68.76,47.31 68.76,45.63 69.81,45.63 U$1.P69 | v78.12,47.94 78.4,47.66 78.4,36.48 79.03,35.85 79.03,9.87 78.05,8.89 v78.05,8.4
  Bottom 0.127: v78.12,47.94 v69.39,47.94 | v78.05,8.4 76.24,6.59 76.24,3.86 22B.1
A4'  (via drill 0.2)
  Top 0.127: v24.27,45.35 25.46,44.16 25.46,31.66 U3.3 | v29.51,48.77 30.56,49.82 30.56,58.48 | 30.56,58.48 30.56,61.98 30.42,62.12 U2.8 | v57.38,57.16 57.38,49.54 57.45,49.47 U$1.P93 | 30.56,58.48 v30.49,58.48
  Bottom 0.127: v24.27,45.35 23.99,45.63 23.01,45.63 22.24,46.4 22.24,47.17 23.01,47.17 23.5,46.68 27.41,46.68 v29.51,48.77 | v57.38,57.16 56.47,58.06 43.48,58.06 42.92,58.62 39.92,58.62 39.64,58.34 30.63,58.34 v30.49,58.48
A5  (via drill 0.2)
  Top 0.127: v71.56,42.98 71.56,44.02 69.88,44.02 U$1.P66 | v73.23,42.98 74.42,41.79 74.42,39.69 v75.19,38.92 | v78.19,35.92 77.92,35.64 77.92,25.79 78.47,25.23 78.47,11.05 v78.12,10.71
  Bottom 0.127: v73.23,42.98 v71.56,42.98 | v78.19,35.92 v75.19,38.92 | v78.12,10.71 73.72,6.31 73.72,3.86 21B.1
A5'  (via drill 0.2)
  Top 0.127: v25.74,44.79 25.74,37.53 25.88,37.39 25.88,31.73 25.95,31.66 U3.4 | v20.08,44.79 19.52,45.35 v19.52,59.39 | v28.88,60.44 29.09,60.65 29.09,62.12 U2.7 | v56.54,60.16 56.54,49.47 U$1.P95
  Bottom 0.127: v20.08,44.79 v25.74,44.79 | v19.52,59.39 21.13,61 28.32,61 28.63,60.68 | v28.88,60.44 28.63,60.68 | v56.54,60.16 56.26,60.44 50.95,60.44 50.67,60.72 28.67,60.72 28.63,60.68
A6  (via drill 0.2)
  Top 0.127: v71.63,8.4 71.63,31.52 69.88,31.52 U$1.P41 | v49.83,9.52 49.83,5.4 48.3,3.86 11A.1
  Bottom 0.127: 20B.1 71.14,3.86 71.63,3.86 v71.63,8.4 69.95,10.08 67.65,10.08 67.37,9.8 50.11,9.8 v49.83,9.52
A6'  (via drill 0.2)
  Top 0.127: v26.37,37.67 26.37,31.73 26.44,31.66 U3.5 | v19.8,39.48 20.64,40.32 20.64,50.52 20.36,50.8 v20.36,59.18 | v27.76,60.44 27.83,60.51 27.83,62.12 U2.6 | v54.38,55.76 54.38,49.54 54.44,49.47 U$1.P99
  Bottom 0.127: v26.37,37.67 24.55,39.48 v19.8,39.48 | v27.76,60.44 27.48,60.72 21.9,60.72 v20.36,59.18 20.5,59.25 23.22,56.53 24.41,56.53 24.48,56.6 40.68,56.6 41.52,55.76 v54.38,55.76
A7  (via drill 0.2)
  Top 0.127: v72.68,37.32 72.68,38.92 71.84,39.76 71.84,42.07 69.88,42.07 U$1.P62 | v74.91,35.43 74.63,35.15 74.63,24.33 v74.91,24.05 | v71.07,23.98 70.72,23.63 v70.72,8.4
  Bottom 0.127: v72.68,37.32 74.56,35.43 v74.91,35.43 | v74.91,24.05 74.84,23.98 v71.07,23.98 | v70.72,8.4 68.62,6.31 68.62,3.86 19B.1
A7'  (via drill 0.2)
  Top 0.127: v36.98,38.09 36.98,39.34 38.17,39.34 U3.38 | v41.59,38.09 41.31,38.37 41.31,46.4 v41.73,46.82 41.73,57.3 v41.87,57.44 | v51.51,46.75 53.4,46.75 53.4,49.33 53.47,49.4 U$1.P101 | v26.65,58.48 26.65,62.12 U2.5
  Bottom 0.127: v41.59,38.09 v36.98,38.09 | v41.73,46.82 42.15,47.24 51.02,47.24 v51.51,46.75 | v26.65,58.48 27.69,57.44 v41.87,57.44
A8  (via drill 0.2)
  Top 0.127: v68.42,41.51 68.42,41.09 69.81,41.09 U$1.P60 | v61.57,29.01 v61.57,39.41 | v69.53,9.52 v69.53,25.72
  Bottom 0.127: v68.42,41.51 61.92,41.51 61.57,41.16 v61.57,39.41 | v61.57,29.01 64.22,26.35 68.9,26.35 v69.53,25.72 | v69.53,9.52 68,7.98 67.79,7.98 66.04,6.24 18B.1
A8'  (via drill 0.2)
  Top 0.127: v40.13,39.48 40.13,39.83 38.24,39.83 U3.39 | v43.2,39.48 43.41,39.69 v43.41,41.72 43.2,41.93 43.2,46.89 43.41,47.1 43.41,49.68 43.2,49.89 43.2,51.99 43.97,51.99 44.32,52.34 44.32,56.95 43.97,57.3 43.97,69.8 v40.82,72.94 | v53.4,42 54.93,43.54 54.93,49.4 U$1.P98 | v28.67,73.43 28.67,74.41 27.9,75.18 U2.27
  Bottom 0.127: v43.2,39.48 v40.13,39.48 | v43.41,41.72 43.69,42 v53.4,42 | v28.67,73.43 29.16,72.94 v40.82,72.94
A9  (via drill 0.2)
  Top 0.127: v71.56,39.28 71.56,40.53 69.88,40.53 U$1.P59 | v74.35,39 74.91,38.44 74.91,36.2 74.35,35.64 74.35,21.74 v74.63,21.46 | v68.14,19.3 67.79,18.95 v67.79,9.45
  Bottom 0.127: v71.56,39.28 71.63,39.2 74.14,39.2 v74.35,39 | v74.63,21.46 74.14,20.97 69.81,20.97 v68.14,19.3 | v67.79,9.45 66.32,7.98 65.2,7.98 63.53,6.31 63.53,3.86 17B.1
A9'  (via drill 0.2)
  Top 0.127: v36.42,37.53 36.42,40.32 38.17,40.32 U3.40 | v54.65,36.83 55.56,37.74 v55.56,45.42 55.56,49.33 55.49,49.4 U$1.P97 | v29.93,66.1 29.93,74.41 29.16,75.18 U2.26 | v72.61,60.72 72.95,60.37 v72.95,45.07
  Bottom 0.127: v36.42,37.53 36.77,37.18 43.06,37.18 43.34,36.9 53.54,36.9 53.68,37.04 54.44,37.04 v54.65,36.83 | v29.93,66.1 31.53,64.49 35.03,64.49 35.17,64.35 54.65,64.35 58.29,60.72 v72.61,60.72 | v72.95,45.07 72.89,45 57.59,45 57.17,45.42 v55.56,45.42
A10  (via drill 0.2)
  Top 0.127: v68.42,39.06 68.42,39.55 69.81,39.55 U$1.P57 | v74.35,37.88 74.07,37.6 v74.07,20.41 | v62.97,17.69 62.27,16.99 v62.27,8.12
  Bottom 0.127: v68.42,39.06 69.6,37.88 v74.35,37.88 | v74.07,20.41 71.35,17.69 v62.97,17.69 | v62.27,8.12 62.27,3.86 61.01,3.86 16B.1
A10'  (via drill 0.2)
  Top 0.127: 39.5,40.88 U3.41 | 39.5,40.88 39.5,41.72 39.85,42.07 v39.85,48.36 | v37.61,48.36 37.61,60.86 37.26,61.21 37.26,64.49 33,68.75 33,75.18 U2.23 | v64.01,32.5 64.01,45.49 62.76,45.49 60.45,47.8 60.45,49.4 U$1.P87 | v42.78,33.2 42.43,33.55 42.43,36.48 40.75,38.16 40.75,39.62 39.5,40.88
  Bottom 0.127: v37.61,48.36 v39.85,48.36 | v64.01,32.5 63.39,31.87 44.11,31.87 v42.78,33.2
A11  (1 unrouted)
A11'  (via drill 0.2)
  Top 0.127: v39.29,48.91 39.29,48.15 39.57,47.87 39.57,42.21 39.22,41.86 39.22,41.37 U3.42 | v56.61,48.01 56.96,48.36 56.96,49.4 U$1.P94 | v31.6,48.77 31.6,58.13 30.91,58.83 30.91,74.69 30.42,75.18 U2.25
  Bottom 0.127: v56.61,48.01 56.26,48.36 45.71,48.36 45.16,48.91 v39.29,48.91 31.74,48.91 v31.6,48.77
A12  (1 unrouted)
A12'  (via drill 0.2)
  Top 0.127: v39.01,47.52 39.08,47.45 39.08,42.14 38.94,42 38.94,41.93 38.24,41.93 U3.43 | v52,47.8 52,49.4 U$1.P104 51.93,49.47 51.93,50.8 51.16,51.57 51.16,59.46 v50.46,60.16 | v25.39,60.16 25.39,62.12 U2.4
  Bottom 0.127: v39.01,47.52 39.29,47.8 v52,47.8 | v25.39,60.16 25.67,59.88 32.44,59.88 32.72,60.16 v50.46,60.16
A13  (1 unrouted)
A13'  (via drill 0.2)
  Top 0.127: v36.98,41.58 36.98,42.35 38.17,42.35 U3.44 | v40.06,41.3 41.03,41.3 v41.03,47.24 41.03,47.94 39.92,49.05 39.92,66.59 v37.61,68.89 | v53.96,47.24 53.96,49.4 U$1.P100 | v27.34,72.52 27.34,74.48 26.65,75.18 U2.28
  Bottom 0.127: v36.98,41.58 37.26,41.3 v40.06,41.3 | v41.03,47.24 41.31,47.52 51.51,47.52 51.79,47.24 v53.96,47.24 | v27.34,72.52 29.16,70.71 35.8,70.71 v37.61,68.89
A14  (via drill 0.2)
  Top 0.127: v68.42,32.5 68.42,33.55 69.81,33.55 U$1.P45 | v75.19,31.03 75.12,30.96 75.12,24.61 75.47,24.26 v75.47,21.04 | v60.38,17.13 59.61,16.36 v59.61,8.12
  Bottom 0.127: v68.42,32.5 69.88,31.03 v75.19,31.03 | v75.47,21.04 71.56,17.13 v60.38,17.13 | v59.61,8.12 59.47,7.98 52.49,7.98 50.81,6.31 50.81,3.86 12B.1
A14'  (via drill 0.2)
  Top 0.127: v36.35,42.7 36.35,42.84 38.17,42.84 U3.45 | v45.08,42.84 v45.08,45.56 45.08,49.68 44.94,49.82 44.94,56.81 v44.88,56.88 | v46.2,45.56 46.69,46.05 47.6,46.05 U$1.P111 | v24.83,58.48 24.83,61.35 24.06,62.12 U2.3
  Bottom 0.127: v36.35,42.7 36.49,42.84 v45.08,42.84 | v46.2,45.56 v45.08,45.56 | v24.83,58.48 26.16,57.16 41.38,57.16 41.66,56.88 v44.88,56.88
A15  (via drill 0.2)
  Top 0.127: v71.49,32.08 71,32.57 69.88,32.57 U$1.P43 | v73.03,27.26 v73.03,31.59 | v53.54,25.16 52.42,24.05 52.42,13.36 v47.46,8.4
  Bottom 0.127: v71.49,32.08 71.98,31.59 v73.03,31.59 | v73.03,27.26 70.93,25.16 v53.54,25.16 | v47.46,8.4 47.46,3.86 48.23,3.86 11B.1
A15'  (via drill 0.2)
  Top 0.127: v48.3,50.03 48.86,49.47 48.86,46.05 48.44,45.63 47.67,45.63 U$1.P112 | U3.46 38.17,43.33 37.4,43.33 37.19,43.12 36.7,43.12 36.7,43.19 36.42,43.47 36.42,45.98 37.05,46.61 v37.05,49.89 37.05,52.2 v35.94,53.31 | v21.55,53.17 21.55,56.53 22.45,57.44 22.45,60.16 22.31,60.3 22.31,63.37 22.73,63.79 22.73,75.18 U2.31
  Bottom 0.127: v37.05,49.89 37.19,50.03 v48.3,50.03 | v21.55,53.17 21.62,53.24 34.68,53.24 34.75,53.31 v35.94,53.31
A16'  (via drill 0.2)
  Top 0.127: v36.98,44.44 36.98,44.37 38.17,44.37 U3.48 | U$1.P114 47.6,44.58 46.83,44.58 46.69,44.44 v46.2,44.44 45.64,45 45.64,45.77 45.36,46.05 45.36,56.18 v45.5,56.32 | v24.2,57.09 23.15,58.13 23.15,61.77 22.8,62.12 U2.2
  Bottom 0.127: v46.2,44.44 v36.98,44.44 | v24.2,57.09 24.41,56.88 41.24,56.88 41.8,56.32 v45.5,56.32
A17'  (via drill 0.2)
  Top 0.127: v36.49,51.01 36.49,47.17 U3.51 | v51.09,50.87 51.44,50.52 51.44,49.47 U$1.P105 | v24.83,65.75 24.83,74.41 24.06,75.18 U2.30 | v26.51,64.07 27.2,63.37 27.2,57.23 27.62,56.81 v27.62,50.87
  Bottom 0.127: v51.09,50.87 36.63,50.87 v36.49,51.01 36.49,50.94 27.69,50.94 v27.62,50.87 | v26.51,64.07 v24.83,65.75
A18'  (via drill 0.2)
  Top 0.127: v35.58,42.7 35.86,42.98 35.86,47.03 35.94,47.1 U3.52 35.94,47.17 35.94,52.55 33.63,54.85 33.63,58.9 v33.49,59.04 | v49.07,43.33 48.72,43.67 48.72,43.81 48.51,44.02 47.67,44.02 U$1.P115 | v21.9,59.95 21.9,61.77 21.55,62.12 U2.1
  Bottom 0.127: v35.58,42.7 36.14,42.14 39.85,42.14 40.27,42.56 44.6,42.56 44.88,42.28 48.02,42.28 v49.07,43.33 | v21.9,59.95 22.8,59.04 v33.49,59.04
B0  (via drill 0.2)
  Top 0.127: v34.54,45.07 34.54,47.1 U3.55 | v44.53,43.61 v44.53,45 | v45.64,43.47 47.6,43.47 47.6,43.54 U$1.P116
  Bottom 0.127: v34.54,45.07 34.61,45 43.27,45 43.55,44.72 44.25,44.72 v44.53,45 | v44.53,43.61 44.67,43.47 v45.64,43.47
B1  (via drill 0.2)
  Top 0.127: v34.4,48.36 34.05,48.01 34.05,47.17 U3.56 | v40.41,46.61 40.47,46.54 v40.47,42 | v44.74,41.16 46.62,43.05 47.6,43.05 U$1.P117
  Bottom 0.127: v34.4,48.36 35.58,47.17 38.59,47.17 39.15,46.61 v40.41,46.61 | v40.47,42 41.31,41.16 v44.74,41.16
B2  (via drill 0.2)
  Top 0.127: v33.56,45.91 33.56,47.03 33.49,47.1 U3.57 | v43.76,45.28 43.97,45.07 43.97,41.16 44.53,40.6 45.64,40.6 45.64,41.65 46.55,42.56 47.6,42.56 U$1.P118
  Bottom 0.127: v33.56,45.91 33.84,45.63 36.91,45.63 37.26,45.28 v43.76,45.28
B3  (via drill 0.2)
  Top 0.127: v36.21,41.3 33,44.51 33,47.1 U3.58 | v46.2,41.44 46.83,42.07 47.6,42.07 U$1.P119
  Bottom 0.127: v36.21,41.3 36.91,40.6 45.36,40.6 v46.2,41.44
B4  (via drill 0.2)
  Top 0.127: v32.65,41.02 32.65,43.67 32.58,43.74 32.58,47.03 32.51,47.1 U3.59 | v49.07,40.95 48.44,41.58 47.67,41.58 U$1.P120
  Bottom 0.127: v32.65,41.02 33.49,40.18 39.64,40.18 39.78,40.32 48.44,40.32 v49.07,40.95
B5  (via drill 0.2)
  Top 0.127: v32.09,43.47 32.09,47.03 32.02,47.1 U3.60 | v42.64,43.4 42.64,39.28 42.99,38.92 44.88,38.92 44.88,39.41 46.34,40.88 46.62,40.88 46.76,41.02 47.6,41.02 U$1.P121
  Bottom 0.127: v32.09,43.47 32.3,43.26 36.63,43.26 36.77,43.12 42.36,43.12 v42.64,43.4
B6  (via drill 0.2)
  Top 0.127: v32.72,38.92 31.53,40.11 31.53,47.1 U3.61 | v45.43,38.92 45.64,39.14 45.64,39.76 45.99,40.11 47.6,40.11 U$1.P123
  Bottom 0.127: v45.43,38.92 v32.72,38.92
B7  (via drill 0.2)
  Top 0.127: v31.05,39.83 31.05,47.1 U3.62 | v46.2,39.55 47.6,39.55 U$1.P124
  Bottom 0.127: v31.05,39.83 31.39,39.48 39.36,39.48 39.92,40.04 45.71,40.04 v46.2,39.55
BAT
  Top 0.127: U3.6 26.92,31.59 26.92,22.37 26.65,22.09 BAT.1
BOOT0
  Top 0.127: R24.1 22.45,27.54 21.83,28.17 21.83,28.59 20.85,29.57 R30.2 20.85,29.64 20.85,35.5 21.2,35.85 21.2,36.34 22.66,36.34 U3.94
CFG_CLK  (via drill 0.2)
  Top 0.127: v36.42,35.99 36.42,36.76 37.47,37.81 38.17,37.81 U3.35 | v57.8,35.01 57.94,34.87 57.94,27.26 U$1.P17
  Bottom 0.127: v36.42,35.99 36.56,35.85 41.17,35.85 41.66,35.36 49.07,35.36 49.28,35.57 57.24,35.57 v57.8,35.01
CFG_DATA  (via drill 0.2)
  Top 0.127: v20.22,34.31 19.94,34.59 19.94,36.13 20.64,36.83 20.64,38.92 22.66,38.92 U3.89 | v15.05,27.33 15.19,27.19 15.19,20.07 18.12,17.13 v18.12,15.32 | v56.4,15.8 57.03,16.43 57.03,27.19 U$1.P15
  Bottom 0.127: v20.22,34.31 19.03,33.13 9.74,33.13 9.39,32.78 9.39,29.98 10.72,29.98 12.88,27.82 14.56,27.82 v15.05,27.33 | v18.12,15.32 22.45,15.32 22.52,15.25 22.94,15.25 23.22,15.53 56.12,15.53 v56.4,15.8
CFG_RESET  (via drill 0.2)
  Top 0.127: v42.5,31.45 41.31,32.64 41.31,35.85 40.19,36.97 40.19,38.37 U3.36 | v41.8,29.84 43.69,27.96 43.69,24.61 46.34,21.95 46.34,20.14 v43.48,17.27 | v57.59,17.34 57.31,17.62 57.31,26.28 57.45,26.42 57.45,27.19 U$1.P16
  Bottom 0.127: v42.5,31.45 42.5,29.84 v41.8,29.84 | v43.48,17.27 43.55,17.34 v57.59,17.34
CS_LLS  (via drill 0.2)
  Top 0.127: v16.73,42 16.73,50.31 16.66,50.38 16.66,55.2 16.03,55.83 R21.2 | v14.07,42 12.81,42 12.81,41.79 MICRO_SD1.2
  Bottom 0.127: v14.07,42 v16.73,42
CTRL_CLK  (via drill 0.2)
  Top 0.127: v23.99,37.6 23.99,38.37 U3.90 | v13.65,37.04 13.09,36.48 13.09,30.89 11.33,29.13 11.33,24.99 12.48,23.84 12.52,23.84 v12.56,23.8 | v52.21,25.79 52.42,26 52.42,27.19 U$1.P6
  Bottom 0.127: v23.99,37.6 23.43,37.04 v13.65,37.04 | v12.56,23.8 12.77,24.01 14.05,22.72 25.88,22.72 27.76,24.61 51.02,24.61 v52.21,25.79
D0  (via drill 0.2)
  Top 0.127: v60.87,17.9 60.87,27.12 60.94,27.19 U$1.P23 | v34.33,16.92 30.49,13.08 30.49,3.86 4A.1 | v36.7,53.31 36.7,62.12 U2.13 | v11,46.19 10.93,46.12 10.93,24.4 12.44,22.89 12.44,21.48 v12.37,21.42
  Bottom 0.127: v60.87,17.9 60.59,18.18 37.12,18.18 35.86,16.92 v34.33,16.92 16.52,16.92 12.37,21.07 v12.37,21.42 | v36.7,53.31 35.58,52.2 30.42,52.2 30.21,52.41 25.81,52.41 25.04,51.64 16.45,51.64 v11,46.19
D1  (via drill 0.2)
  Top 0.127: v62.2,18.18 62.55,18.53 62.55,27.19 U$1.P26 62.55,27.26 62.55,28.1 62.69,28.24 62.69,43.61 v62.41,43.88 | v35.66,17.48 33.07,14.9 33.07,3.86 5A.1 | v38.03,65.54 38.03,62.19 U2.14 | v44.53,65.54 48.58,61.49 v48.58,59.6 | v74.07,56.04 74.63,55.48 v74.63,45.07
  Bottom 0.127: v62.2,18.18 61.92,18.46 36.63,18.46 v35.66,17.48 | v44.53,65.54 v38.03,65.54 | v48.58,59.6 48.72,59.46 66.67,59.46 70.09,56.04 v74.07,56.04 | v74.63,45.07 73.44,43.88 v62.41,43.88
D2  (via drill 0.2)
  Top 0.127: v63.11,20.9 62.97,21.04 62.97,27.19 U$1.P27 62.97,27.26 v62.97,44.44 | v43.34,19.58 36.91,13.15 36.91,5.19 35.58,3.86 6A.1 | v39.36,59.6 39.36,62.12 U2.15 | v65.34,58.9 67.72,56.53 v67.72,54.43 | v74.07,53.66 74.07,45.42 v73.72,45.07
  Bottom 0.127: v63.11,20.9 62.62,20.41 44.18,20.41 v43.34,19.58 | v39.36,59.6 40.06,58.9 v65.34,58.9 | v67.72,54.43 68.48,53.66 v74.07,53.66 | v73.72,45.07 73.09,44.44 v62.97,44.44
D3  (via drill 0.2)
  Top 0.127: v64.08,8.96 66.39,11.27 66.39,27.12 66.46,27.19 U$1.P34 66.46,27.26 66.46,31.17 v64.57,33.06 | v45.36,8.96 43.2,6.79 43.2,3.86 9A.1 | v51.51,33.9 51.51,37.95 49.69,39.76 49.69,45.56 49.14,46.12 49.14,70.85 44.94,70.85 40.61,75.18 U2.17
  Bottom 0.127: v64.08,8.96 63.81,8.68 47.95,8.68 47.67,8.96 v45.36,8.96 | v51.51,33.9 52.35,33.06 v64.57,33.06
D4  (via drill 0.2)
  Top 0.127: v68.97,14.69 68.97,25.93 71.21,28.17 71.21,30.54 69.88,30.54 U$1.P39 | v51.86,14.69 45.78,8.61 45.78,3.86 10A.1 | v40.47,56.04 41.1,56.67 41.1,70.08 40.06,71.13 40.06,74.48 39.36,75.18 U2.18 | v5.06,53.38 4.92,53.24 4.92,22.44 4.29,21.81 v4.29,19.44
  Bottom 0.127: v68.97,14.69 v51.86,14.69 51.02,13.85 9.88,13.85 v4.29,19.44 | v40.47,56.04 40.19,56.32 24.62,56.32 24.06,55.76 20.5,55.76 18.68,57.58 15.33,57.58 11.14,53.38 v5.06,53.38
D5  (via drill 0.2)
  Top 0.127: v65.69,11.34 65.69,26 65.62,26.07 65.62,27.12 65.55,27.19 U$1.P32 | 43.51,9.34 40.68,6.52 40.68,3.86 8A.1 | 43.51,9.34 v44.25,10.08 | v36.07,68.54 38.03,70.5 38.03,75.18 U2.19 | v20.5,68.54 12.6,60.65 12.6,56.11 12.12,55.62 8.41,55.62 8.41,53.17 9.95,51.64 9.95,43.26 9.04,42.35 9.04,33.27 7.16,31.38 v7.16,24.19 | v40.61,14.41 43.48,11.54 43.48,9.38 43.51,9.34
  Bottom 0.127: v65.69,11.34 64.43,10.08 v44.25,10.08 | v20.5,68.54 v36.07,68.54 | v7.16,24.19 11.84,19.51 11.84,14.2 29.51,14.2 29.72,14.41 v40.61,14.41
D6  (via drill 0.2)
  Top 0.127: v64.01,22.37 64.01,27.19 U$1.P29 | v45.78,21.74 43.9,19.86 43.9,18.46 38.1,12.66 7A.1 | v37.47,71.83 37.47,74.48 36.77,75.18 U2.20 | v77.22,64 78.75,62.47 78.75,61.28 80.57,59.46 82.45,59.46 82.45,56.46 79.87,53.87 79.87,31.66 81.2,30.33 81.2,27.54 v79.87,26.21
  Bottom 0.127: v45.78,21.74 63.39,21.74 v64.01,22.37 76.03,22.37 v79.87,26.21 | v37.47,71.83 38.24,71.06 70.02,71.06 77.08,64 v77.22,64
D7  (via drill 0.2)
  Top 0.127: v54.65,16.09 54.65,15.25 56.61,15.25 59.96,18.6 59.96,27.19 U$1.P21 60.03,27.26 60.03,28.1 60.73,28.8 60.73,39.55 v62.13,40.95 | v22.73,15.8 22.8,15.73 22.8,3.86 1A.1 | v37.26,65.26 35.52,67 35.52,75.18 U2.21 | v74.42,61.28 76.1,59.6 v76.1,40.95
  Bottom 0.127: v54.65,16.09 54.38,15.8 v22.73,15.8 | v37.26,65.26 37.54,64.98 61.78,64.98 65.48,61.28 v74.42,61.28 | v62.13,40.95 v76.1,40.95
DI_LLS  (via drill 0.2)
  Top 0.127: v5.06,55.06 5.06,58.06 3.38,59.74 R17.2 | v6.18,53.94 7.44,52.69 7.44,51.08 9.39,49.12 v9.39,45.98 | v11.49,43.88 12.47,42.91 12.74,42.91 MICRO_SD1.3
  Bottom 0.127: v6.18,53.94 v5.06,55.06 | v11.49,43.88 v9.39,45.98
DOWN
  Top 0.127: U$1.P79 64.5,49.47 64.5,63.72 67.3,66.52 J2.2
EN_M1_NOT  (via drill 0.2)
  Top 0.127: v36.49,27.33 36.49,31.59 U3.25 | v48.37,27.05 48.09,27.33 48.09,28.73 48.72,29.36 48.72,31.31 48.51,31.52 47.67,31.52 U$1.P140
  Bottom 0.127: v36.49,27.33 48.09,27.33 v48.37,27.05
FIRE
  Top 0.127: U$1.P82 63.04,49.47 63.11,49.54 63.11,51.92 63.46,52.27 63.46,64.21 62.9,64.77 62.9,65.96 63.39,66.45 63.39,67 64.57,68.19 68.69,68.19 68.69,69.31 J2.6
FLASH_CS  (via drill 0.2)
  Top 0.127: v68.42,30.12 69.81,30.12 U$1.P38 | v75.68,30.4 75.75,30.47 75.75,40.53 75.54,40.74 75.54,44.51 75.82,44.79 75.82,57.72 v74.07,59.46 | v54.44,63.79 53.82,63.16 53.82,62.88 U4.1
  Bottom 0.127: v68.42,30.12 68.69,30.4 v75.68,30.4 | v74.07,59.46 73.37,60.16 58.08,60.16 v54.44,63.79
FLASH_MISO  (via drill 0.2)
  Top 0.127: v69.46,50.87 68.48,49.89 68.48,43.61 69.81,43.61 U$1.P65 | v51.72,52.76 51.93,52.97 51.93,60.23 53.26,61.56 53.75,61.56 U4.2
  Bottom 0.127: v69.46,50.87 69.46,51.99 63.18,51.99 63.11,51.92 62.55,51.92 61.71,52.76 v51.72,52.76
FLASH_MOSI  (via drill 0.2)
  Top 0.127: v65.55,54.92 68.2,52.27 68.2,43.12 69.81,43.12 U$1.P64 | v62.55,55.76 60.52,57.79 60.52,59.04 U4.5
  Bottom 0.127: v65.55,54.92 64.71,55.76 v62.55,55.76
FLASH_SCLK  (via drill 0.2)
  Top 0.127: v70.86,51.01 70.86,46.12 69.88,46.12 U$1.P70 | v62.9,52.48 63.11,52.69 63.11,58.2 61.01,60.3 60.52,60.3 U4.6
  Bottom 0.127: v70.86,51.01 69.39,52.48 v62.9,52.48
GET_CTRL_REG  (via drill 0.2)
  Top 0.127: v30,51.85 28.95,50.8 28.95,47.17 U3.66 | v45.92,48.91 v45.92,51.43 | v58.78,47.94 57.94,47.1 v57.94,43.88 | v52.28,39.28 52.07,39.06 52.07,27.33 52,27.26 U$1.P5
  Bottom 0.127: v30,51.85 30.07,51.92 43.48,51.92 43.55,51.99 45.36,51.99 v45.92,51.43 | v45.92,48.91 46.2,48.63 58.08,48.63 v58.78,47.94 | v57.94,43.88 53.33,39.28 v52.28,39.28
GET_DATA_REG  (via drill 0.2)
  Top 0.127: v23.99,42.91 23.99,44.3 22.73,44.3 U3.78 | v20.08,42.91 19.24,42.07 v19.24,29.01 | v40.89,29.84 43.13,27.61 v43.13,25.38 | v49.83,25.65 50.46,26.28 50.46,27.19 U$1.P2
  Bottom 0.127: v20.08,42.91 v23.99,42.91 | v19.24,29.01 20.08,29.84 25.88,29.84 26.58,30.54 37.19,30.54 37.89,29.84 v40.89,29.84 | v43.13,25.38 43.41,25.65 v49.83,25.65
GND  (via drill 0.2)
  Top 0.3: v68.9,51.43 68.9,53.66 C4.1 68.9,53.87 68.9,54.85 69.18,55.13 v69.18,57.72 | v67.65,51.43 67.65,50.24 67.51,50.1 67.51,49.47 | 67.51,49.47 U$1.P73 | v60.59,51.43 60.59,53.31 60.17,53.31 C25.2 | v65.34,51.29 65.48,51.15 65.48,49.47 U$1.P77 | v71.28,45.56 71.21,45.56 70.72,45.07 69.88,45.07 U$1.P68 | v67.58,45.56 67.72,45.7 67.72,49.33 67.65,49.4 67.51,49.47 | v77.56,42.28 77.43,42.42 77.43,44.65 v77.56,44.79 | IC5.1 75.4,14.9 74.28,14.9 74.21,14.83 74.21,14.55 73.09,14.55 C33.2 73.09,14.69 v73.09,16.43 | U$1.P3 50.95,27.19 51.02,27.12 51.02,26.07 51.09,26 51.09,23 50.6,22.51 50.6,21.6 49.97,21.6 C26.2 49.83,21.6 49.42,21.6 49.42,19.72 v49.56,19.58 | U$1.P13 55.98,27.19 55.98,26.35 56.05,26.28 56.05,23.7 55.84,23.49 v55.84,19.58 55.91,19.44 v55.91,16.43 | v46.2,33.13 46.27,33.13 46.76,33.62 47.6,33.62 U$1.P136 | v43.62,33.13 43.55,33.2 v43.55,37.46 | v46.2,37.46 46.34,37.32 46.34,36.97 46.69,36.62 47.6,36.62 U$1.P130 | v62.13,32.43 62.27,32.29 62.27,28.52 62.2,28.45 62.2,28.38 61.99,28.17 61.99,27.26 U$1.P25 61.99,27.12 61.99,26.35 62.06,26.28 62.06,25.93 62.13,25.86 62.13,20.21 61.78,19.86 61.78,18.67 61.57,18.46 v61.57,16.09 | v56.96,32.43 56.82,32.57 v56.82,37.53 56.68,37.6 56.54,37.6 56.54,44.37 56.89,44.72 v57.03,44.79 57.03,45.98 | v68.2,37.11 68.2,36.34 68.97,35.57 69.81,35.57 U$1.P49 | v71.84,36.69 71.91,36.76 71.91,37.95 70.86,37.95 70.72,38.09 69.88,38.09 U$1.P54 | v49.07,45.42 48.86,45.42 48.51,45.07 47.67,45.07 U$1.P113 | v50.25,45.42 50.11,45.56 50.11,48.42 49.97,48.56 49.97,49.4 U$1.P108 | 55.35,59.53 55.35,61.91 | 55.35,61.91 55.35,64.14 56.68,64.14 C24.2 56.82,64.14 57.1,64.14 57.1,67.84 v56.96,67.98
  Top 0.3: 55.35,59.53 54.86,59.04 53.82,59.04 U4.4 | 55.35,59.53 55.49,59.46 56.05,58.9 56.05,54.99 55.84,54.78 55.84,51.5 56.12,51.22 56.12,50.45 55.98,50.31 55.98,49.47 U$1.P96 55.98,49.33 55.98,47.38 57.03,47.38 | 57.03,47.38 57.31,47.38 58.5,48.56 58.5,49.4 U$1.P91 | v63.18,67.77 63.18,69.31 J2.8 | 57.03,47.38 57.03,45.98 | v57.17,45.98 57.03,45.98 | 20.78,20.55 20.78,23.28 R25.1 | 20.78,20.55 20.15,19.93 20.15,19.02 19.73,19.02 C12.1 19.52,19.09 19.59,19.02 19.52,18.95 19.52,16.57 C11.1 19.38,16.43 v19.38,12.38 | 30.56,23.98 30.56,25.38 30.07,25.38 C23.1 30.56,25.51 v30.56,29.01 | 30.56,23.98 30.56,21.39 30.14,21.39 C5.1 30,21.39 29.09,21.39 29.02,21.32 v29.02,20.55 28.95,20.41 v28.95,4 | v33.14,23.98 33.14,25.38 33.56,25.38 C22.1 33.7,25.38 34.26,25.38 v34.26,26.7 34.12,26.77 34.12,30.75 33.98,30.89 33.98,31.59 U3.20 | v30.42,23.98 30.56,23.98 | v41.03,26.77 41.03,28.1 41.17,28.1 C18.2 | v28.95,29.01 28.95,31.59 U3.10 | v37.12,26.77 37.12,33.48 37.54,33.9 38.17,33.9 U3.27 | v20.92,20.55 20.78,20.55 | v40.55,69.87 40.55,62.19 U2.16 | v24.97,54.08 24.97,52.2 | 24.97,52.2 24.97,47.17 U3.74 | v29.37,54.08 29.37,55.83 C7.2 29.37,55.97 v29.37,57.99 | C10.2 43.13,56.04 42.71,56.04 v42.71,58.06 42.85,58.13 43.48,58.76 43.48,62.33 | v43.27,69.73 43.27,66.1 43.48,65.89 43.48,62.33 | v18.61,71.06 18.61,71.13 19.73,71.13 19.73,70.99 C19.2 | IC10.2 2.55,66.03 v3.8,66.03 3.87,66.03 3.87,66.94 3.94,67 5.06,67 IC10.6 | LED3.P1 8.34,73.57 8.34,74.55 LED3.P2 8.34,74.76 8.34,75.67 LED3.P3 | 7.99,65.96 v7.99,57.16 v7.99,52.83 | 7.99,65.96 8.06,66.03 8.83,66.03 C3.2 8.9,66.17 8.9,68.12 C1.2 8.76,68.12 8.62,68.12 8.62,70.92 8.48,71.06 8.48,73.5 LED3.P1
  Top 0.3: v7.65,66.03 7.85,66.03 7.99,65.96 | v14.7,73.29 14.7,71.13 JP1.1 | v9.6,73.29 9.39,73.5 8.62,73.5 LED3.P1 | 21.83,33.69 21.83,33.06 22.45,32.43 22.45,29.64 R30.1 | 21.83,33.69 22.03,33.9 22.66,33.9 U3.99 | v17.15,34.8 17.15,37.95 C2.2 | v21.48,34.59 21.55,34.53 21.55,33.97 21.62,33.9 21.69,33.9 21.76,33.83 21.83,33.69 | v11.98,34.25 11.98,35.78 MICRO_SD1.MP4 | J3.SH4 2.06,14.06 2.06,22.65 J3.SH3 | MICRO_SD1.6 12.74,46.19 11.63,46.19 11.63,50.87 11.98,50.87 MICRO_SD1.MP1 11.49,50.94 v11.49,52.9 | v7.92,22.65 7.92,26 8.34,26 IC2.1 | v2.76,33.69 2.76,35.08 2.34,35.08 MICRO_SD1.MP3 | v2.76,52.9 2.76,50.87 2.34,50.87 MICRO_SD1.MP2 | v6.32,52.83 6.32,34.04 6.25,33.97 6.25,33.76 v6.11,33.69 6.25,33.55 6.25,22.72 J3.SH1 6.8,22.1 J3.A1_B12 | v24.83,52.2 24.97,52.2 | v6.39,11.75 6.25,11.89 J3.SH2 6.24,14.58 J3.B1_A12 | v55.49,61.91 55.35,61.91 | v43.34,62.33 43.48,62.33
  Bottom 0.3: v68.9,51.43 v67.65,51.43 65.34,51.43 | v60.59,51.43 60.73,51.57 62.34,51.57 62.48,51.43 65.34,51.43 | v65.34,51.29 65.34,51.43 | v77.56,42.28 77.64,42.21 81.76,42.21 JP2.2 | v77.56,44.79 77.43,44.93 77.29,44.93 76.52,45.7 72.68,45.7 72.54,45.56 v71.28,45.56 v67.58,45.56 67.51,45.7 67.09,46.12 57.31,46.12 v57.17,45.98 | v69.18,57.72 69.32,57.58 71.91,57.58 73.17,58.83 79.87,58.83 80.29,58.41 81.41,58.41 S1.1 | v55.84,19.58 55.7,19.72 49.69,19.72 v49.56,19.58 | v73.09,16.43 72.19,16.43 71.98,16.22 69.18,16.22 68.9,15.95 61.57,15.95 | 61.57,15.95 59.19,15.95 58.71,16.43 v55.91,16.43 | v43.62,33.13 v46.2,33.13 | v43.55,37.46 43.69,37.32 46.06,37.32 v46.2,37.46 55.35,37.46 55.42,37.53 v56.82,37.53 56.89,37.39 57.03,37.25 59.47,37.25 59.68,37.46 67.02,37.46 67.37,37.11 v68.2,37.11 68.28,36.97 70.72,36.97 71,36.69 v71.84,36.69 | v62.13,32.43 61.99,32.57 57.1,32.57 v56.96,32.43 | v49.07,45.42 v50.25,45.42 50.32,45.28 50.81,44.79 v57.03,44.79 | v63.18,67.77 62.97,67.98 v56.96,67.98 | v61.57,16.09 61.57,15.95 | 5B.1 33.07,3.86 33,3.93 32.93,3.86 30.49,3.86 4B.1 30.42,4 v28.95,4 | v30.42,23.98 v33.14,23.98 | v41.03,26.77 40.89,26.63 37.12,26.63 | 37.12,26.63 37.05,26.63 36.98,26.7 v34.26,26.7 | v30.56,29.01 v28.95,29.01 | v37.12,26.77 37.12,26.63 | v20.92,20.55 27.2,20.55 27.27,20.62 28.95,20.62 v29.02,20.55 | 43.27,69.87 45.71,69.87 JP8.2 | 43.27,69.87 v40.55,69.87 | v24.97,54.08 25.11,54.22 29.23,54.22 v29.37,54.08 | v42.71,58.06 41.59,58.06 41.38,57.86 29.51,57.86 v29.37,57.99 | v43.27,69.73 43.27,69.87 | v18.61,71.06 14.7,71.06 JP1.1 | v7.99,57.16 JP4.2 | v7.65,66.03 v3.8,66.03
  Bottom 0.3: v9.6,73.29 v14.7,73.29 | v21.48,34.59 21.34,34.59 20.99,34.94 17.28,34.94 v17.15,34.8 17.08,34.66 12.4,34.66 v11.98,34.25 11.91,34.11 11.63,33.83 6.18,33.83 v6.11,33.69 v2.76,33.69 | J3.SH4 2.06,13.99 5.27,13.99 5.34,13.92 6.11,13.92 6.18,13.99 J3.SH2 | v7.92,22.65 J3.SH1 6.11,22.72 5.34,22.72 5.27,22.65 2.06,22.65 J3.SH3 | v2.76,52.9 3.66,52.9 3.87,52.69 6.18,52.69 v6.32,52.83 6.39,52.69 8.06,52.69 8.1,52.72 | 8.1,52.72 8.27,52.9 v11.49,52.9 11.56,52.76 12.12,52.2 v24.83,52.2 | v7.99,52.83 8.1,52.72 | v19.38,12.38 17.63,12.38 17.35,12.1 14.49,12.1 14.28,11.89 6.53,11.89 v6.39,11.75 | v55.49,61.91 55.35,62.05 47.88,62.05 47.6,62.33 v43.34,62.33
LE_IL  (via drill 0.2)
  Top 0.127: v27.48,23.56 27.48,31.59 U3.7 | v56.47,23.21 56.47,27.19 U$1.P14
  Bottom 0.127: v27.48,23.56 27.83,23.21 v56.47,23.21
LEDB  (via drill 0.2)
  Top 0.127: v13.86,67.15 9.39,71.62 R3.1 | v17.56,64.07 20.99,60.65 20.99,51.71 22.03,50.66 22.03,49.05 21.69,48.7 21.69,44.3 22.1,43.88 22.66,43.88 U3.79
  Bottom 0.127: v13.86,67.15 16.94,64.07 v17.56,64.07
LEDG  (via drill 0.2)
  Top 0.127: v6.39,69.94 6.39,71.62 R13.1 | v70.44,58.2 71.84,56.81 71.84,45.28 72.68,44.44 v72.68,42.42 | v62.13,42.28 60.17,40.32 v60.17,35.57 | v32.93,34.8 32.51,34.39 32.51,31.66 U3.17